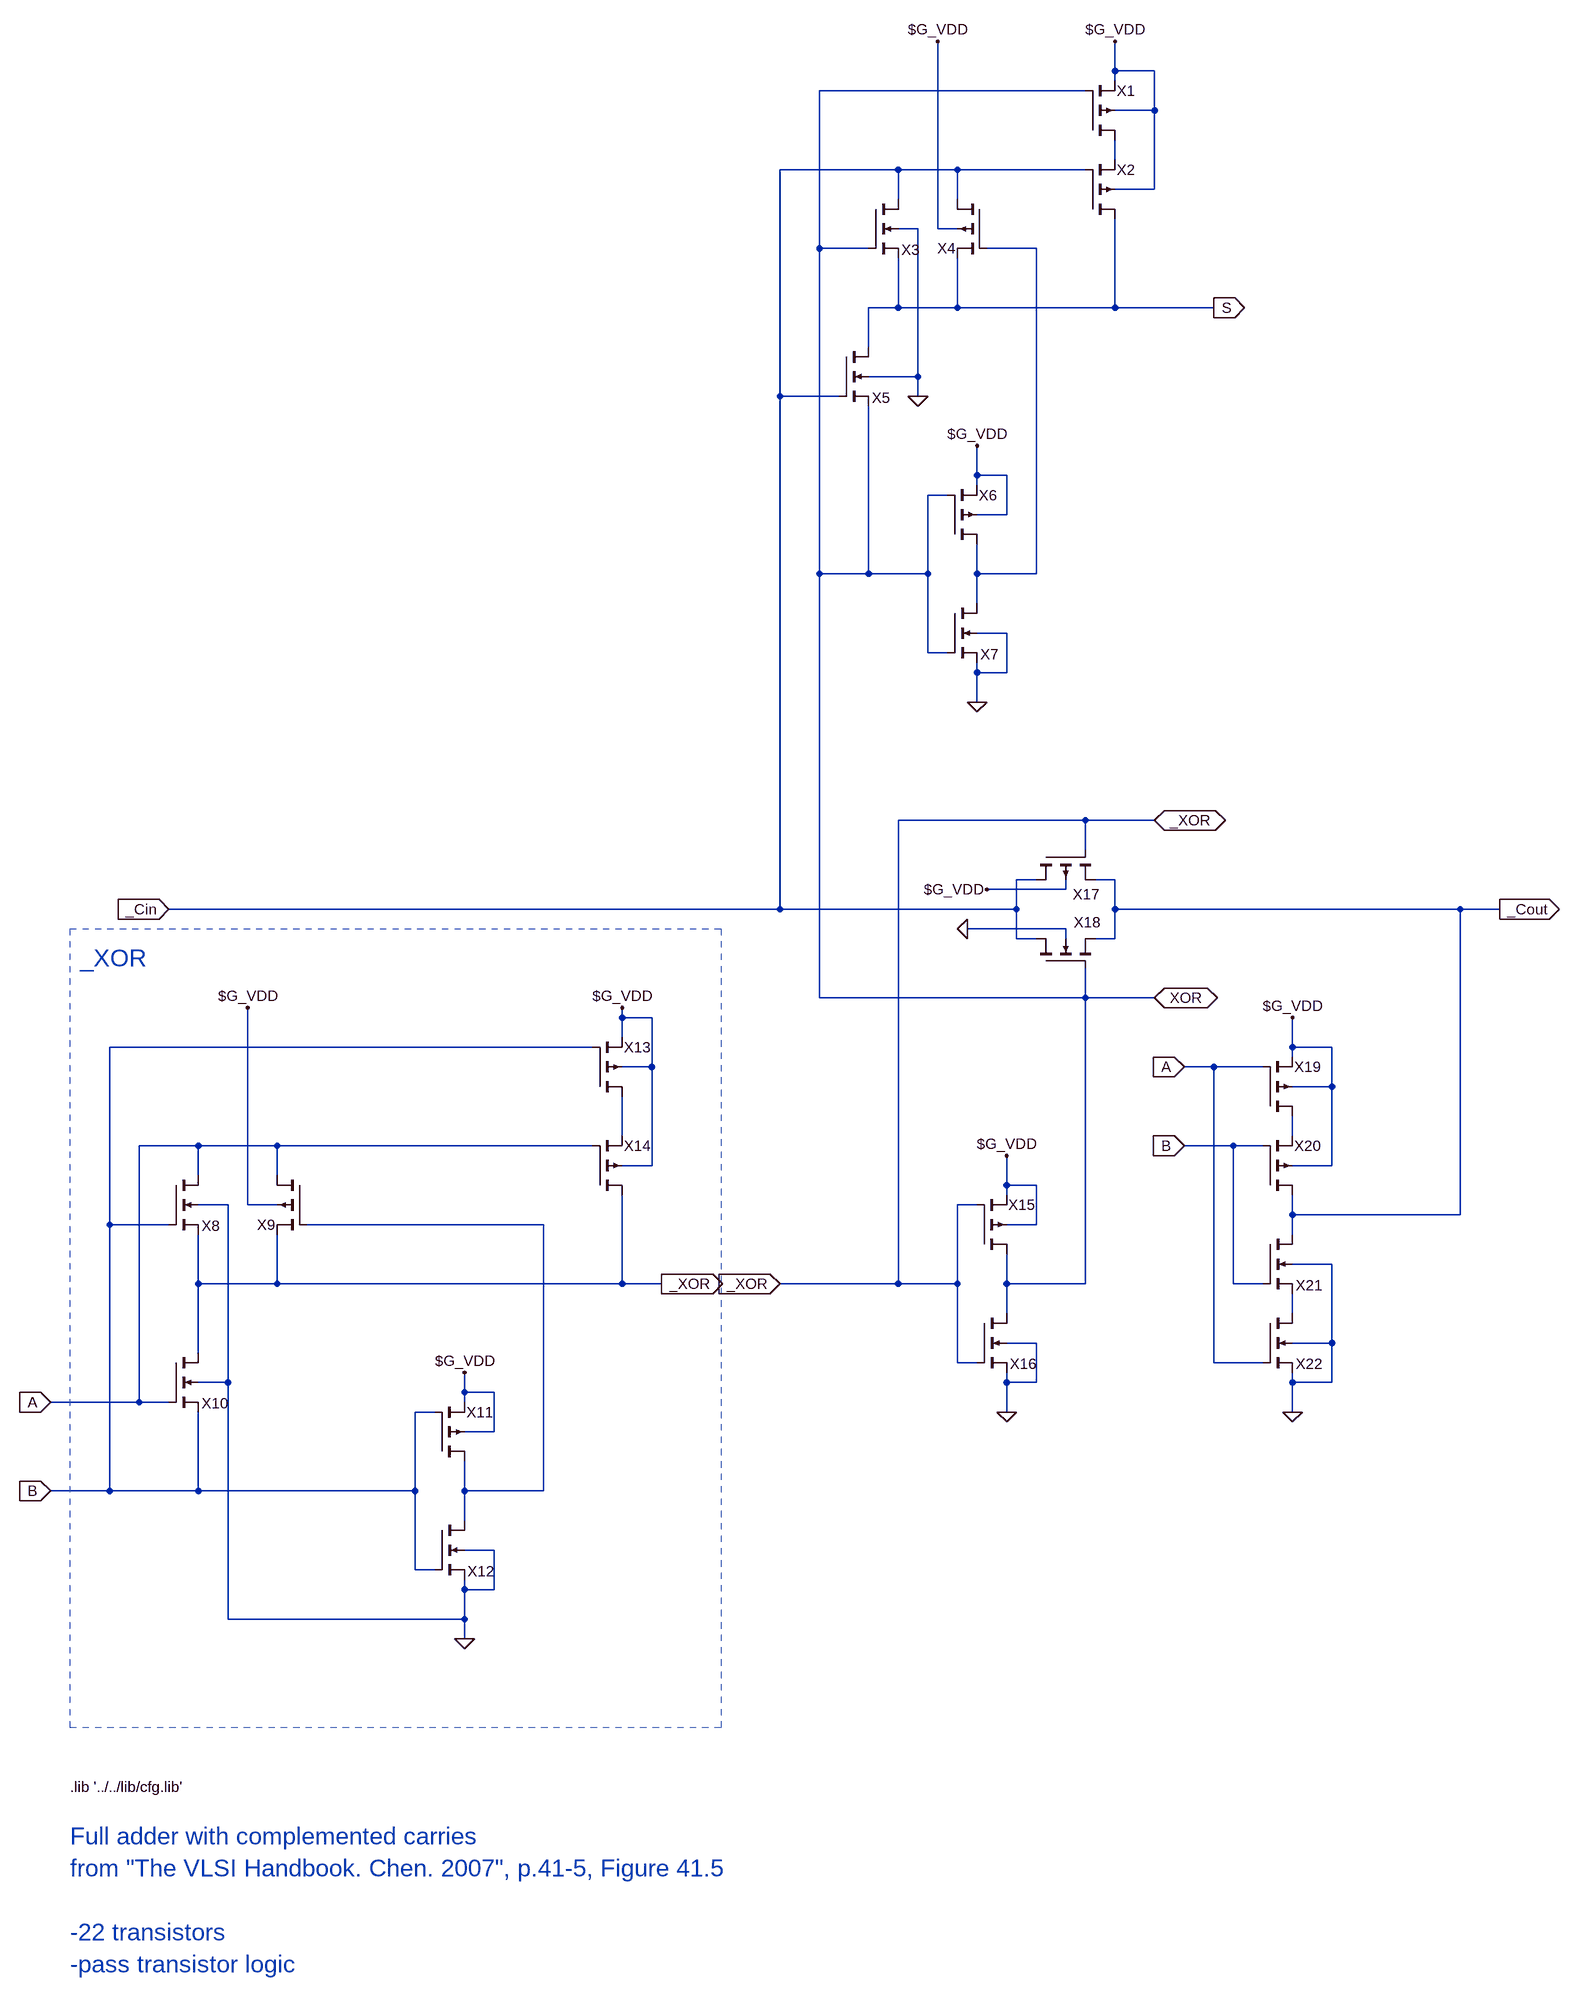
[diagram p0: schematic fa2.asc]
fa2.asc, the LTspice schematic file:
Version 4
SHEET 1 2652 2568
WIRE -1600 -512 -1600 -560
WIRE -1536 -512 -1600 -512
WIRE -1600 -496 -1600 -512
WIRE -1648 -480 -2080 -480
WIRE -1536 -448 -1536 -512
WIRE -1536 -448 -1600 -448
WIRE -1600 -368 -1600 -400
WIRE -1952 -352 -2144 -352
WIRE -1856 -352 -1952 -352
WIRE -1648 -352 -1856 -352
WIRE -1536 -320 -1536 -448
WIRE -1536 -320 -1600 -320
WIRE -1952 -304 -1952 -352
WIRE -1856 -304 -1856 -352
WIRE -1920 -256 -1952 -256
WIRE -1888 -256 -1888 -560
WIRE -1856 -256 -1888 -256
WIRE -2080 -224 -2080 -480
WIRE -2000 -224 -2080 -224
WIRE -1728 -224 -1808 -224
WIRE -1952 -128 -1952 -208
WIRE -1952 -128 -2000 -128
WIRE -1856 -128 -1856 -208
WIRE -1856 -128 -1952 -128
WIRE -1600 -128 -1600 -272
WIRE -1600 -128 -1856 -128
WIRE -1440 -128 -1600 -128
WIRE -2000 -64 -2000 -128
WIRE -1920 -16 -1920 -256
WIRE -1920 -16 -2000 -16
WIRE -2144 16 -2144 -352
WIRE -2048 16 -2144 16
WIRE -1920 16 -1920 -16
WIRE -1824 144 -1824 96
WIRE -1776 144 -1824 144
WIRE -1824 160 -1824 144
WIRE -1872 176 -1904 176
WIRE -1776 208 -1776 144
WIRE -1776 208 -1824 208
WIRE -2080 304 -2080 -224
WIRE -2000 304 -2000 32
WIRE -2000 304 -2080 304
WIRE -1904 304 -1904 176
WIRE -1904 304 -2000 304
WIRE -1824 304 -1824 256
WIRE -1728 304 -1728 -224
WIRE -1728 304 -1824 304
WIRE -1824 352 -1824 304
WIRE -1776 400 -1824 400
WIRE -1904 432 -1904 304
WIRE -1872 432 -1904 432
WIRE -1824 464 -1824 448
WIRE -1776 464 -1776 400
WIRE -1776 464 -1824 464
WIRE -1824 512 -1824 464
WIRE -1648 704 -1952 704
WIRE -1536 704 -1648 704
WIRE -1648 752 -1648 704
WIRE -1728 800 -1760 800
WIRE -1600 800 -1632 800
WIRE -1680 816 -1680 800
WIRE -1680 816 -1808 816
WIRE -2144 848 -2144 16
WIRE -2144 848 -3136 848
WIRE -1760 848 -1760 800
WIRE -1760 848 -2144 848
WIRE -1600 848 -1600 800
WIRE -1040 848 -1600 848
WIRE -976 848 -1040 848
WIRE -1680 880 -1840 880
WIRE -1760 896 -1760 848
WIRE -1728 896 -1760 896
WIRE -1680 896 -1680 880
WIRE -1600 896 -1600 848
WIRE -1600 896 -1632 896
WIRE -2080 992 -2080 304
WIRE -1648 992 -1648 944
WIRE -1648 992 -2080 992
WIRE -1536 992 -1648 992
WIRE -2400 1024 -2400 1008
WIRE -2352 1024 -2400 1024
WIRE -2400 1056 -2400 1024
WIRE -2448 1072 -3232 1072
WIRE -1312 1072 -1312 1024
WIRE -1248 1072 -1312 1072
WIRE -1312 1088 -1312 1072
WIRE -2352 1104 -2352 1024
WIRE -2352 1104 -2400 1104
WIRE -1440 1104 -1488 1104
WIRE -1360 1104 -1440 1104
WIRE -1248 1136 -1248 1072
WIRE -1248 1136 -1312 1136
WIRE -2400 1216 -2400 1152
WIRE -1312 1216 -1312 1184
WIRE -3088 1232 -3184 1232
WIRE -2960 1232 -3088 1232
WIRE -2448 1232 -2960 1232
WIRE -1408 1232 -1488 1232
WIRE -1360 1232 -1408 1232
WIRE -2352 1264 -2352 1104
WIRE -2352 1264 -2400 1264
WIRE -1248 1264 -1248 1136
WIRE -1248 1264 -1312 1264
WIRE -3088 1280 -3088 1232
WIRE -2960 1280 -2960 1232
WIRE -1776 1296 -1776 1248
WIRE -1728 1296 -1776 1296
WIRE -1776 1312 -1776 1296
WIRE -3040 1328 -3088 1328
WIRE -3008 1328 -3008 1008
WIRE -2960 1328 -3008 1328
WIRE -1824 1328 -1856 1328
WIRE -1312 1344 -1312 1312
WIRE -1040 1344 -1040 848
WIRE -1040 1344 -1312 1344
WIRE -3232 1360 -3232 1072
WIRE -3136 1360 -3232 1360
WIRE -2528 1360 -2912 1360
WIRE -1728 1360 -1728 1296
WIRE -1728 1360 -1776 1360
WIRE -1312 1376 -1312 1344
WIRE -1248 1424 -1312 1424
WIRE -3088 1456 -3088 1376
WIRE -2960 1456 -2960 1376
WIRE -2960 1456 -3088 1456
WIRE -2400 1456 -2400 1312
WIRE -2400 1456 -2960 1456
WIRE -2336 1456 -2400 1456
WIRE -1952 1456 -1952 704
WIRE -1952 1456 -2144 1456
WIRE -1856 1456 -1856 1328
WIRE -1856 1456 -1952 1456
WIRE -1776 1456 -1776 1408
WIRE -1648 1456 -1648 992
WIRE -1648 1456 -1776 1456
WIRE -1408 1456 -1408 1232
WIRE -1360 1456 -1408 1456
WIRE -1776 1504 -1776 1456
WIRE -1312 1504 -1312 1472
WIRE -1728 1552 -1776 1552
WIRE -1248 1552 -1248 1424
WIRE -1248 1552 -1312 1552
WIRE -3088 1568 -3088 1456
WIRE -1856 1584 -1856 1456
WIRE -1824 1584 -1856 1584
WIRE -1440 1584 -1440 1104
WIRE -1360 1584 -1440 1584
WIRE -3040 1616 -3040 1328
WIRE -3040 1616 -3088 1616
WIRE -1776 1616 -1776 1600
WIRE -1728 1616 -1728 1552
WIRE -1728 1616 -1776 1616
WIRE -1312 1616 -1312 1600
WIRE -1248 1616 -1248 1552
WIRE -1248 1616 -1312 1616
WIRE -2656 1632 -2656 1600
WIRE -2608 1632 -2656 1632
WIRE -3184 1648 -3184 1232
WIRE -3184 1648 -3328 1648
WIRE -3136 1648 -3184 1648
WIRE -2656 1648 -2656 1632
WIRE -2704 1664 -2736 1664
WIRE -1776 1664 -1776 1616
WIRE -1312 1664 -1312 1616
WIRE -2608 1696 -2608 1632
WIRE -2608 1696 -2656 1696
WIRE -3232 1792 -3232 1360
WIRE -3232 1792 -3328 1792
WIRE -3088 1792 -3088 1664
WIRE -3088 1792 -3232 1792
WIRE -2736 1792 -2736 1664
WIRE -2736 1792 -3088 1792
WIRE -2656 1792 -2656 1744
WIRE -2528 1792 -2528 1360
WIRE -2528 1792 -2656 1792
WIRE -2656 1840 -2656 1792
WIRE -2608 1888 -2656 1888
WIRE -2736 1920 -2736 1792
WIRE -2704 1920 -2736 1920
WIRE -2656 1952 -2656 1936
WIRE -2608 1952 -2608 1888
WIRE -2608 1952 -2656 1952
WIRE -3040 2000 -3040 1616
WIRE -2656 2000 -2656 1952
WIRE -2656 2000 -3040 2000
WIRE -2656 2032 -2656 2000
FLAG -1600 -560 $G_VDD
FLAG -1440 -128 S
IOPIN -1440 -128 Out
FLAG -1824 96 $G_VDD
FLAG -1824 512 0
FLAG -3136 848 _Cin
IOPIN -3136 848 In
FLAG -1312 1024 $G_VDD
FLAG -1312 1664 0
FLAG -1488 1104 A
IOPIN -1488 1104 In
FLAG -1488 1232 B
IOPIN -1488 1232 In
FLAG -976 848 _Cout
IOPIN -976 848 Out
FLAG -1776 1248 $G_VDD
FLAG -1776 1664 0
FLAG -2656 1600 $G_VDD
FLAG -2656 2032 0
FLAG -3328 1792 B
IOPIN -3328 1792 In
FLAG -3328 1648 A
IOPIN -3328 1648 In
FLAG -2400 1008 $G_VDD
FLAG -1536 992 XOR
IOPIN -1536 992 BiDir
FLAG -1536 704 _XOR
IOPIN -1536 704 BiDir
FLAG -3008 1008 $G_VDD
FLAG -1840 880 0
FLAG -1808 816 $G_VDD
FLAG -1888 -560 $G_VDD
FLAG -1920 16 0
FLAG -2336 1456 _XOR
IOPIN -2336 1456 Out
FLAG -2144 1456 _XOR
IOPIN -2144 1456 In
SYMBOL pmos4 -1648 -400 M180
WINDOW 0 51 80 Left 2
WINDOW 3 52 23 Invisible 2
SYMATTR InstName X1
SYMATTR Value pmos_t1
SYMATTR Prefix X
SYMBOL pmos4 -1648 -272 M180
WINDOW 0 51 80 Left 2
WINDOW 3 52 23 Invisible 2
SYMATTR InstName X2
SYMATTR Value pmos_t1
SYMATTR Prefix X
SYMBOL pmos4 -1808 -304 M0
WINDOW 0 51 80 Left 2
WINDOW 3 52 23 Invisible 2
SYMATTR InstName X4
SYMATTR Value pmos_t1
SYMATTR Prefix X
SYMBOL nmos4 -2000 -304 R0
WINDOW 0 53 82 Left 2
WINDOW 3 53 23 Invisible 2
SYMATTR InstName X3
SYMATTR Value nmos_t1
SYMATTR Prefix X
SYMBOL nmos4 -2048 -64 R0
WINDOW 0 53 82 Left 2
WINDOW 3 53 23 Invisible 2
SYMATTR InstName X5
SYMATTR Value nmos_t1
SYMATTR Prefix X
SYMBOL pmos4 -1872 256 M180
WINDOW 0 51 80 Left 2
WINDOW 3 52 23 Invisible 2
SYMATTR InstName X6
SYMATTR Value pmos_t1
SYMATTR Prefix X
SYMBOL nmos4 -1872 352 R0
WINDOW 0 53 82 Left 2
WINDOW 3 53 23 Invisible 2
SYMATTR InstName X7
SYMATTR Value nmos_t1
SYMATTR Prefix X
SYMBOL pmos4 -1728 752 M90
WINDOW 0 72 102 VLeft 2
WINDOW 3 52 23 Invisible 2
SYMATTR InstName X17
SYMATTR Value pmos_t1
SYMATTR Prefix X
SYMBOL nmos4 -1728 944 R270
WINDOW 0 75 61 VRight 2
WINDOW 3 53 23 Invisible 2
SYMATTR InstName X18
SYMATTR Value nmos_t1
SYMATTR Prefix X
SYMBOL pmos4 -1360 1184 M180
WINDOW 0 51 80 Left 2
WINDOW 3 52 23 Invisible 2
SYMATTR InstName X19
SYMATTR Value pmos_t1
SYMATTR Prefix X
SYMBOL pmos4 -1360 1312 M180
WINDOW 0 51 80 Left 2
WINDOW 3 52 23 Invisible 2
SYMATTR InstName X20
SYMATTR Value pmos_t1
SYMATTR Prefix X
SYMBOL nmos4 -1360 1376 R0
WINDOW 0 53 82 Left 2
WINDOW 3 53 23 Invisible 2
SYMATTR InstName X21
SYMATTR Value nmos_t1
SYMATTR Prefix X
SYMBOL nmos4 -1360 1504 R0
WINDOW 0 53 82 Left 2
WINDOW 3 53 23 Invisible 2
SYMATTR InstName X22
SYMATTR Value nmos_t1
SYMATTR Prefix X
SYMBOL pmos4 -1824 1408 M180
WINDOW 0 51 80 Left 2
WINDOW 3 52 23 Invisible 2
SYMATTR InstName X15
SYMATTR Value pmos_t1
SYMATTR Prefix X
SYMBOL nmos4 -1824 1504 R0
WINDOW 0 53 82 Left 2
WINDOW 3 53 23 Invisible 2
SYMATTR InstName X16
SYMATTR Value nmos_t1
SYMATTR Prefix X
SYMBOL pmos4 -2704 1744 M180
WINDOW 0 51 80 Left 2
WINDOW 3 52 23 Invisible 2
SYMATTR InstName X11
SYMATTR Value pmos_t1
SYMATTR Prefix X
SYMBOL nmos4 -2704 1840 R0
WINDOW 0 53 82 Left 2
WINDOW 3 53 23 Invisible 2
SYMATTR InstName X12
SYMATTR Value nmos_t1
SYMATTR Prefix X
SYMBOL nmos4 -3136 1568 R0
WINDOW 0 53 82 Left 2
WINDOW 3 53 23 Invisible 2
SYMATTR InstName X10
SYMATTR Value nmos_t1
SYMATTR Prefix X
SYMBOL nmos4 -3136 1280 R0
WINDOW 0 53 82 Left 2
WINDOW 3 53 23 Invisible 2
SYMATTR InstName X8
SYMATTR Value nmos_t1
SYMATTR Prefix X
SYMBOL pmos4 -2912 1280 M0
WINDOW 0 51 80 Left 2
WINDOW 3 52 23 Invisible 2
SYMATTR InstName X9
SYMATTR Value pmos_t1
SYMATTR Prefix X
SYMBOL pmos4 -2448 1312 M180
WINDOW 0 51 80 Left 2
WINDOW 3 52 23 Invisible 2
SYMATTR InstName X14
SYMATTR Value pmos_t1
SYMATTR Prefix X
SYMBOL pmos4 -2448 1152 M180
WINDOW 0 51 80 Left 2
WINDOW 3 52 23 Invisible 2
SYMATTR InstName X13
SYMATTR Value pmos_t1
SYMATTR Prefix X
TEXT -3296 2272 Left 2 !.lib '../../lib/cfg.lib'
TEXT -3280 928 Left 4 ;_XOR
TEXT -3296 2352 Left 4 ;Full adder with complemented carries\nfrom "The VLSI Handbook. Chen. 2007", p.41-5, Figure 41.5\n \n-22 transistors\n-pass transistor logic
RECTANGLE Normal -2240 2176 -3296 880 1

The netlist it stands for:
* fa2.asc
XX1 N001 XOR $G_VDD $G_VDD pmos_t1  ; pins D G S B
XX2 S _Cin N001 $G_VDD pmos_t1  ; pins D G S B
XX4 _Cin N002 S $G_VDD pmos_t1  ; pins D G S B
XX3 _Cin XOR S 0 nmos_t1  ; pins D G S B
XX5 S _Cin XOR 0 nmos_t1  ; pins D G S B
XX6 N002 XOR $G_VDD $G_VDD pmos_t1  ; pins D G S B
XX7 N002 XOR 0 0 nmos_t1  ; pins D G S B
XX17 _Cin _XOR _Cout $G_VDD pmos_t1  ; pins D G S B
XX18 _Cin XOR _Cout 0 nmos_t1  ; pins D G S B
XX19 N004 A $G_VDD $G_VDD pmos_t1  ; pins D G S B
XX20 _Cout B N004 $G_VDD pmos_t1  ; pins D G S B
XX21 _Cout B N006 0 nmos_t1  ; pins D G S B
XX22 N006 A 0 0 nmos_t1  ; pins D G S B
XX15 XOR _XOR $G_VDD $G_VDD pmos_t1  ; pins D G S B
XX16 XOR _XOR 0 0 nmos_t1  ; pins D G S B
XX11 N005 B $G_VDD $G_VDD pmos_t1  ; pins D G S B
XX12 N005 B 0 0 nmos_t1  ; pins D G S B
XX10 _XOR A B 0 nmos_t1  ; pins D G S B
XX8 A B _XOR 0 nmos_t1  ; pins D G S B
XX9 A N005 _XOR $G_VDD pmos_t1  ; pins D G S B
XX14 _XOR A N003 $G_VDD pmos_t1  ; pins D G S B
XX13 N003 B $G_VDD $G_VDD pmos_t1  ; pins D G S B
.lib '../../lib/cfg.lib'
* _XOR
* Full adder with complemented carries
* from "The VLSI Handbook. Chen. 2007", p.41-5, Figure 41.5
* -22 transistors
* -pass transistor logic
.backanno
.end